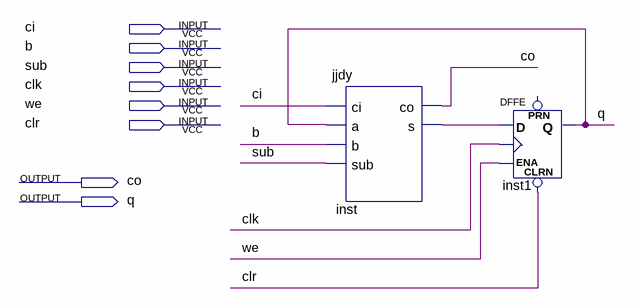
[diagram p0: schematic sheet]
// Quartus schematic jshqdy.bdf as structural Verilog: 2 symbols, 8 pins
module jshqdy (
  input  ci,
  input  b,
  input  sub,
  input  clk,
  input  we,
  input  clr,
  output co,
  output q
);

  wire inst_s;

  jjdy inst (.ci(ci), .a(q), .b(b), .sub(sub), .co(co), .s(inst_s));
  DFFE inst1 (.CLRN(clr), .D(inst_s), .CLK(clk), .ENA(we), .Q(q));  // open: PRN
endmodule
